# Altium schematic sheet RS485.SchDoc
size A4
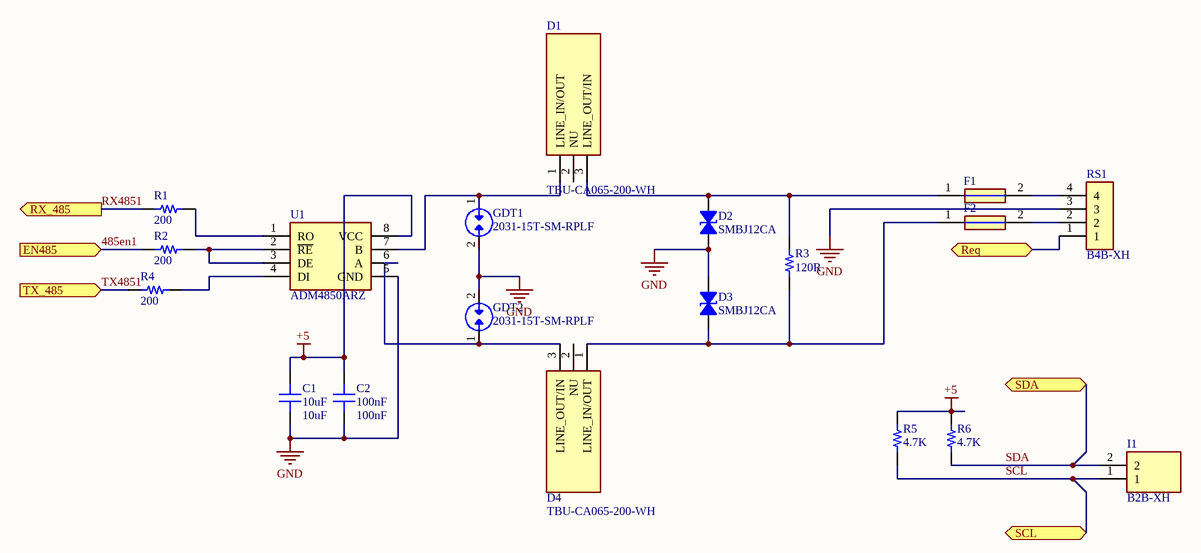
[diagram p0: RS485.SchDoc]

## Parts
C1  10uF  [cap805]
C2  100nF  [cap805]
D1  TBU-CA065-200-WH  [TBUCA025050WH]
D2  SMBJ12CA  [DO214AA SMB]
D3  SMBJ12CA  [DO214AA SMB]
D4  TBU-CA065-200-WH  [TBUCA025050WH]
F1  fuse 100mAmp  [fuse3216]  (value not drawn)
F2  fuse 100mAmp  [fuse3216]  (value not drawn)
GDT1  2031-15T-SM-RPLF  [TVS_2031-15T-SM-RPLF]
GDT2  2031-15T-SM-RPLF  [TVS_2031-15T-SM-RPLF]
I1  B2B-XH  [JST-B2B-XH]
R1  200  [0603R]
R2  200  [0603R]
R3  120R  [0603R]
R4  200  [0603R]
R5  4.7K  [0603R]
R6  4.7K  [0603R]
RS1  B4B-XH  [JST-B4B-XH]
U1  ADM4850ARZ  [SO8_N]

## Ports
EN485 (in), Req (bidir), RX_485 (out), SCL (bidir), SDA (bidir), TX_485 (in)

## Nets
+5: C1.1 C2.1 R5.1 R6.1 U1.8(VCC)
GND: C1.2 C2.2 D2.1 D3.2 GDT1.2 GDT2.2 RS1.3 U1.5(GND)
485en1: R2.2 ; port EN485
Req: RS1.1 ; port Req
RX4851: R1.2 ; port RX_485
SCL: I1.1 R5.2 ; port SCL
SDA: I1.2 R6.2 ; port SDA
TX4851: R4.2 ; port TX_485
NetD1_1: D1.1(LINE_IN/OUT) GDT1.1 U1.7(B)
NetD1_3: D1.3(LINE_OUT/IN) D2.2 F1.1 R3.1
NetD3_1: D3.1 D4.1(LINE_IN/OUT) F2.1 R3.2
NetD4_3: D4.3(LINE_OUT/IN) GDT2.1 U1.6(A)
NetF1_2: F1.2 RS1.4
NetF2_2: F2.2 RS1.2
NetR1_1: R1.1 U1.1(RO)
NetR2_1: R2.1 U1.2(~{RE}) U1.3(DE)
NetR4_1: R4.1 U1.4(DI)

Not connected (* = marked no-connect by the designer): D1 2(NU); D4 2(NU)

## Library data of the parts
C1 C2 = Capacitor: CAP SMD 0805; Part Number: C0805X106K9RAC7800
  C1: Value: 10uF
  C2: Value: 100nF
D1 D4 = TBU-CA065-200-WH: TVS Diode (Bi-directional); Manufacturer_Name: Bourns; Datasheet Link: https://www.bourns.com/data/global/pdfs/TBU-CA.pdf; Height: 1mm; Manufacturer_Part_Number: TBU-CA065-200-WH; Mouser Part Number: 652-TBU-CA065-200-WH; Mouser Price/Stock: https://www.mouser.co.uk/ProductDetail/Bourns/TBU-CA065-200-WH?qs=kLtMOTa49OkdVs42fYbv8A%3D%3D; Arrow Part Number: TBU-CA065-200-WH; Arrow Price/Stock: https://www.arrow.com/en/products/tbu-ca065-200-wh/bourns?region=nac
D2 D3 = SMBJ12CA: TVS DIODE 12V 19.9V SMB; Manufacturer: AVX Corporation; Bidirectional Channels: 1; Current - Peak Pulse (10/1000µs): 30.15A; Power Line Protection: No; Power - Peak Pulse: 600W; Type: Zener; Voltage - Breakdown (Min): 13.3V; Part Number: SMBJ12CA; Applications: General Purpose; ComponentLink1Description: Datasheet; ComponentLink1URL: //media.digikey.com/pdf/Data%20Sheets/AVX%20PDFs/Transient%20Suppression%20Diodes.pdf; ComponentLink2Description: DigiKey Link; ComponentLink2URL: http://digikey.com/product-detail/en/avx-corporation/SMBJ12CA/478-7062-1-ND/3340353; LastUpdated: 9/2/2020 1:28:17 AM; Lifecycle Status: Active; Minimum Order: 1; Mounting Type: Surface Mount; Operating Temperature: -55°C ~ 150°C (TJ); Package / Case: DO-214AA, SMB; Packaging: TapeAndReel; PartId: 9012; Part Status: Active; Price: 0.16; Series: -; Supplier 1: DigiKey; Supplier Part Number 1: 478-7062-1-ND; Supplier Device Package: SMB; Voltage - Clamping (Max) @ Ipp: 19.9V; Voltage - Reverse Standoff (Typ): 12V
F1 F2 = 1206SFS200F_63-2: Fuse 1206; Manufacturer_Name: TE Connectivity; Manufacturer_Part_Number: 1206SFS200F/63-2; Datasheet Link: http://docs-emea.rs-online.com/webdocs/13b6/0900766b813b6e27.pdf; Height: 1.17mm
GDT1 GDT2 = 2031-15T-SM-RPLF: Gas Discharge Tube SMD; Package: None; Price: None; Value: *; MP: 2031-15T-SM-RPLF; Availability: Unavailable
I1 = B2B-XH: XH 2pin standing
R1-R6 = CRCW080510K0JNEAIF: RES SMD 0603; Manufacturer: Vishay Dale; Power (Watts): 0.125W, 1/8W; Resistance: 10 kOhms; Temperature Coefficient: ±200ppm/°C; Tolerance: ±5%; Part Number: CRCW080510K0JNEAIF; ComponentLink1Description: Datasheet; ComponentLink1URL: http://www.vishay.com/docs/20024/dcrcwife3.pdf; ComponentLink2Description: DigiKey Link; ComponentLink2URL: http://digikey.com/product-detail/en/vishay-dale/CRCW080510K0JNEAIF/541-10KAPCT-ND/3477322; Composition: Thick Film; Device Package: 0805 (2012 Metric); Features: Automotive AEC-Q200, Pulse Withstanding; Height - Seated (Max): 0.020" (0.50mm); LastUpdated: 9/2/2020 1:14:55 AM; Lifecycle Status: Active; Minimum Order: 1; Number of Terminations: 2; Operating Temperature: -55°C ~ 155°C; Package / Case: 0805 (2012 Metric); Packaging: TapeAndReel; PartId: 40891; Part Status: Active; Price: 0.08; Ratings: AEC-Q200; Series: CRCW-IF; Size / Dimension: 0.079" L x 0.049" W (2.00mm x 1.25mm); Supplier 1: DigiKey; Supplier Part Number 1: 541-10KAPCT-ND; Supplier Device Package: 0805
  R1 R2 R4: Value: 200
  R3: Value: 120R
  R5 R6: Value: 4.7K
RS1 = B4B-XH: XH 4pin standing
U1 = ADM4850ARZ: MAX485 SMD; Manufacturer_Name: Analog Devices; Datasheet Link: http://www.analog.com/static/imported-files/data_sheets/ADM4850_4851_4852_4853_4854_4855_4856_4857.pdf; Height: 1.75mm; Manufacturer_Part_Number: ADM4850ARZ; Mouser Part Number: 584-ADM4850ARZ; Mouser Price/Stock: https://www.mouser.com/Search/Refine.aspx?Keyword=584-ADM4850ARZ; Arrow Part Number: ADM4850ARZ; Arrow Price/Stock: https://www.arrow.com/en/products/adm4850arz/analog-devices